# EAGLE schematic CapstoneProject16_latest (EAGLE 7.5.0)
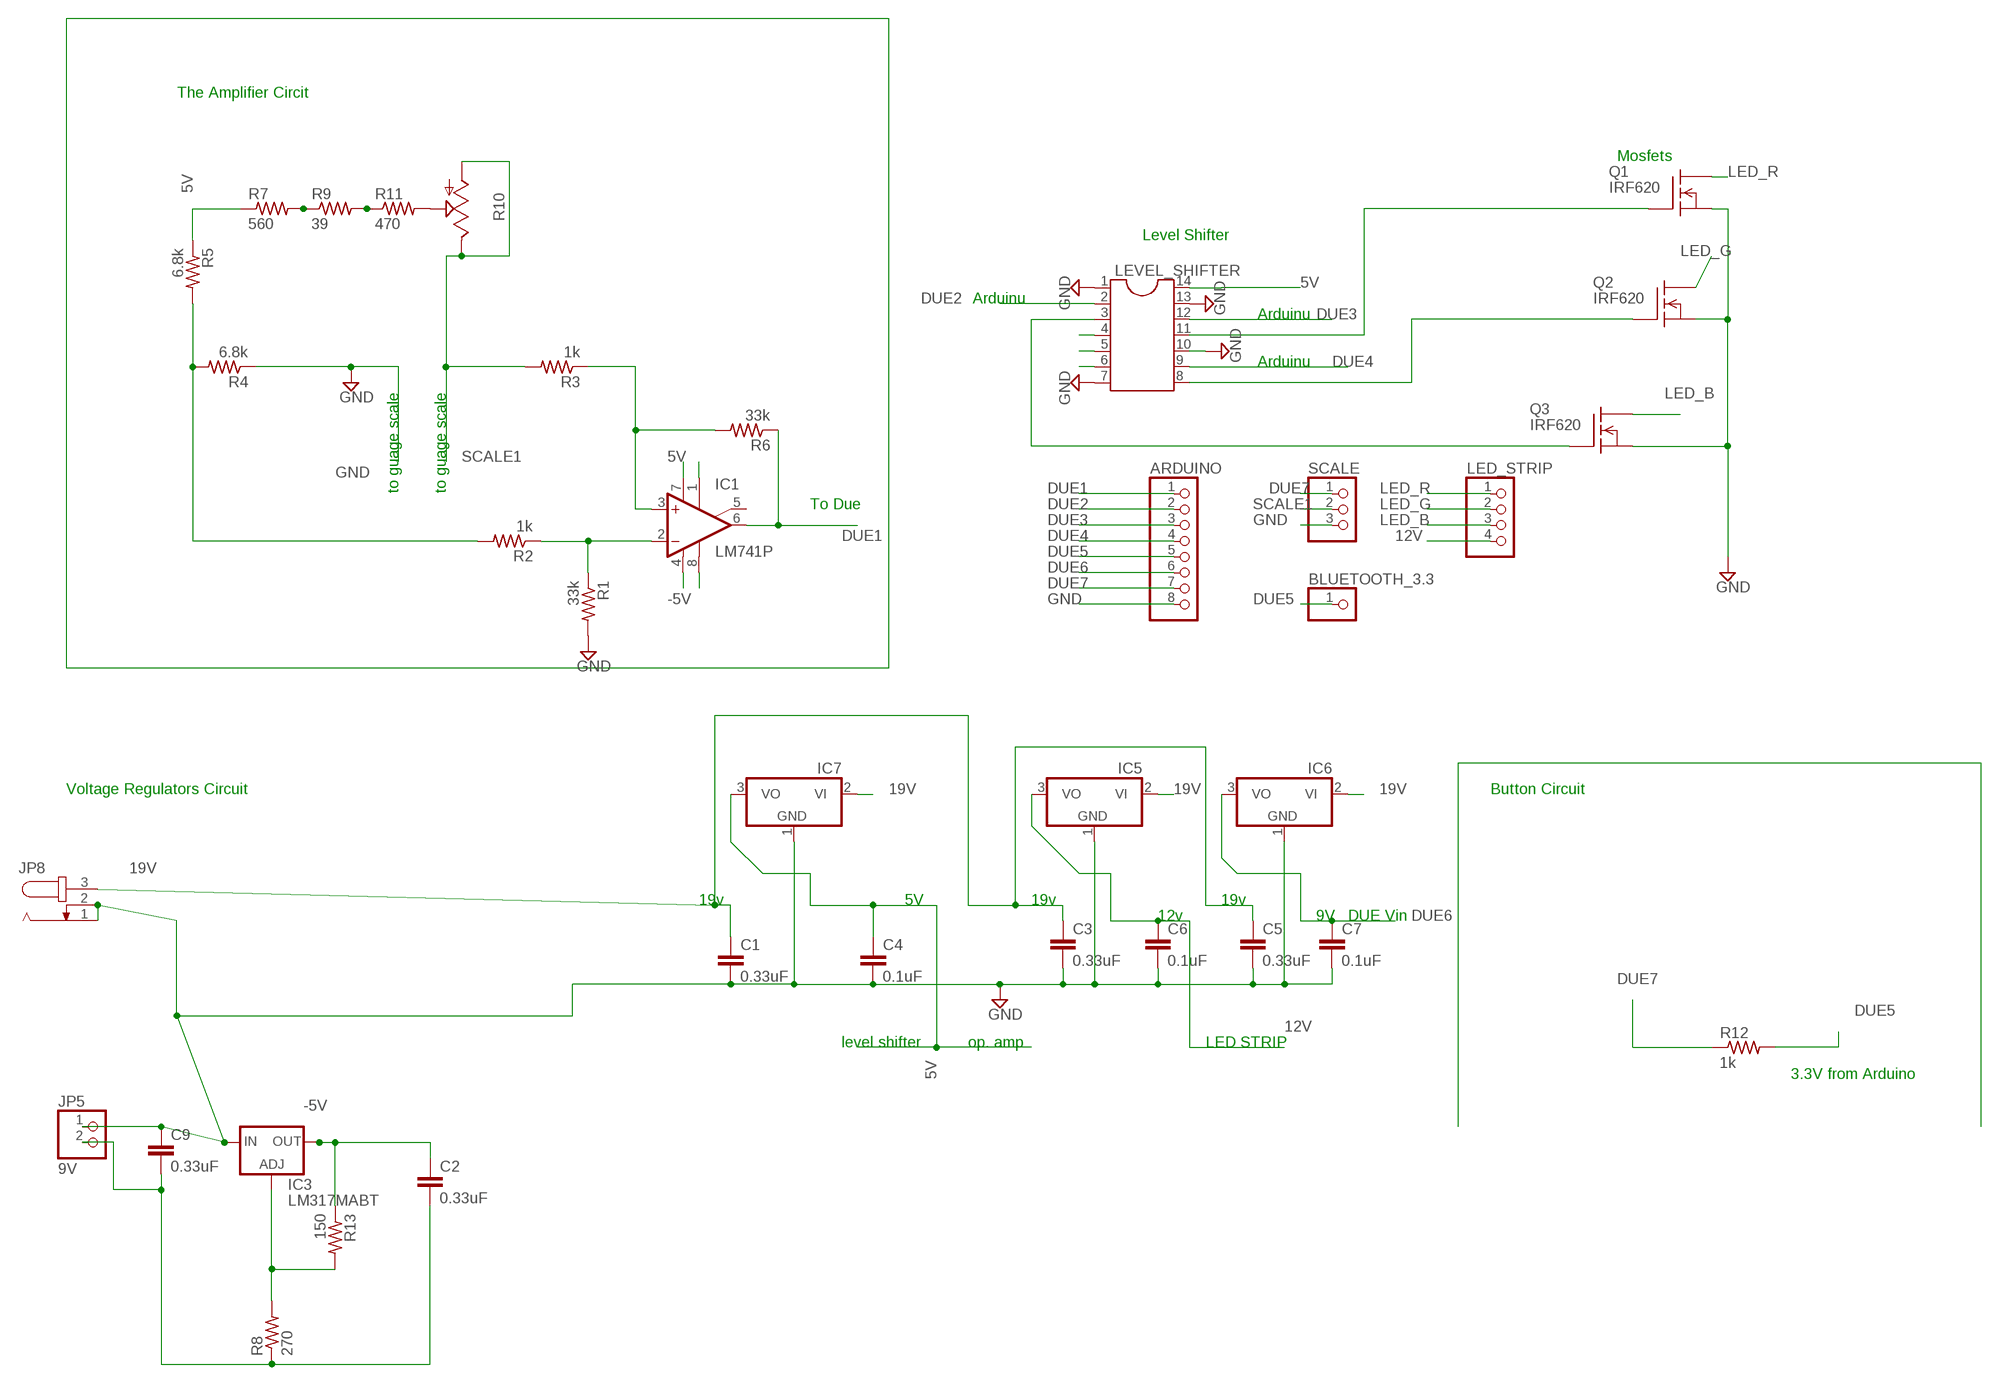
[diagram p0: schematic, sheet 1]

## Parts
ARDUINO  PINHD-1X8  [1X08]
BLUETOOTH_3.3  PINHD-1X1  [1X01]
C1  0.33uF  C2,5-3  [C2.5-3]
C2  0.33uF  C2,5-3  [C2.5-3]
C3  0.33uF  C2,5-3  [C2.5-3]
C4  0.1uF  C2,5-3  [C2.5-3]
C5  0.33uF  C2,5-3  [C2.5-3]
C6  0.1uF  C2,5-3  [C2.5-3]
C7  0.1uF  C2,5-3  [C2.5-3]
C9  0.33uF  C2,5-3  [C2.5-3]
IC1  LM741P  [DIL08]
IC3  LM317MABT  [TO220L1]
IC5  7905T  [TO220H]
IC6  7905T  [TO220H]
IC7  79L05Z  [TO92]
JP5  9V  PINHD-1X2  [1X02]
JP8  JACK-PLUG1  [SPC4078]
LED_STRIP  PINHD-1X4  [1X04]
LEVEL_SHIFTER  DIL14  [DIL14]
Q1  IRF620  [TO220]
Q2  IRF620  [TO220]
Q3  IRF620  [TO220]
R1  33k  R-US_0204/7  [0204/7]
R2  1k  R-US_0204/7  [0204/7]
R3  1k  R-US_0204/7  [0204/7]
R4  6.8k  R-US_0204/7  [0204/7]
R5  6.8k  R-US_0204/7  [0204/7]
R6  33k  R-US_0204/7  [0204/7]
R7  560  R-US_0204/7  [0204/7]
R8  270  R-US_0204/7  [0204/7]
R9  39  R-US_0204/7  [0204/7]
R10  TRIM_US-S63P  [S63P]
R11  470  R-US_0204/7  [0204/7]
R12  1k  R-US_0204/7  [0204/7]
R13  150  R-US_0204/7  [0204/7]
SCALE  PINHD-1X3  [1X03]

## Nets
5V: C4.1 IC1.7(V+) IC7.3(VO) LEVEL_SHIFTER.14 R5.1 R7.1
12V: C6.1 IC5.3(VO) LED_STRIP.4
19V: C1.1 C3.1 C5.1 IC5.2(VI) IC6.2(VI) IC7.2(VI) JP8.3
-5V: C2.1 IC1.4(V-) IC3.2(OUT) R13.1
DUE1: ARDUINO.1 IC1.6(OUT) R6.1
DUE2: ARDUINO.2 LEVEL_SHIFTER.2
DUE3: ARDUINO.3 LEVEL_SHIFTER.12
DUE4: ARDUINO.4 LEVEL_SHIFTER.9
DUE5: ARDUINO.5 BLUETOOTH_3.3.1 R12.2
DUE6: ARDUINO.6 C7.1 IC6.3(VO)
DUE7: ARDUINO.7 R12.1 SCALE.1
GND: ARDUINO.8 C1.2 C3.2 C4.2 C5.2 C6.2 C7.2 C9.1 IC3.3(IN) IC5.1(GND) IC6.1(GND) IC7.1(GND) JP5.1 JP8.1 JP8.2 LEVEL_SHIFTER.1 LEVEL_SHIFTER.7 LEVEL_SHIFTER.10 LEVEL_SHIFTER.13 Q1.3(S) Q2.3(S) Q3.3(S) R1.2 R4.1 SCALE.3
LED_B: LED_STRIP.3 Q3.2(D)
LED_G: LED_STRIP.2 Q2.2(D)
LED_R: LED_STRIP.1 Q1.2(D)
N$2: R2.2 R4.2 R5.2
N$3: IC1.2(-IN) R1.1 R2.1
N$4: IC1.3(+IN) R3.1 R6.2
N$5: LEVEL_SHIFTER.4
N$6: R10.S R11.2
N$8: LEVEL_SHIFTER.5
N$9: R7.2 R9.1
N$10: LEVEL_SHIFTER.6
N$12: C2.2 C9.2 JP5.2 R8.1
N$13: IC3.1(ADJ) R8.2 R13.2
N$15: R9.2 R11.1
N$27: LEVEL_SHIFTER.11 Q1.1(G)
N$28: LEVEL_SHIFTER.8 Q2.1(G)
N$29: LEVEL_SHIFTER.3 Q3.1(G)
N$31: IC1.1(ON1)
N$33: IC1.8(OPT)
SCALE1: R3.2 R10.A R10.E SCALE.2
Unconnected: IC1.5(ON2)

## Notes on the sheet
- The Amplifier Circit
- Mosfets
- Level Shifter
- Arduinu
- Arduinu
- Arduinu
- to guage scale | to guage scale
- To Due
- Voltage Regulators Circuit | Button Circuit
- 19v | 5V | 19v | 19v
- 12v | 9V | DUE Vin
- level shifter | op. amp | LED STRIP
- 3.3V from Arduino

## Library data of the parts
ARDUINO = pinhead:PINHD-1X8: PIN HEADER
BLUETOOTH_3.3 = pinhead:PINHD-1X1: PIN HEADER
C1-C7 C9 = capacitor-wima:C: CAPACITOR naming: grid - package width
IC1 = linear:*741: OP AMP
IC3 = v-reg:LM317?*: 500 mA Adjustable Output Positive Voltage Regulator Source: http://www.onsemi.co.jp .. LM317M-D.PDF
IC5-IC7 = linear:79*: Negative VOLTAGE REGULATOR
JP5 = pinhead:PINHD-1X2: PIN HEADER
JP8 = con-jack:JACK-PLUG: DC POWER JACK Power Jack, DC, Right Angle, Through Hole, Rated 5A at 16VDC, PC Terminals Distributor: Farnell (www.Farnell.de) Drawing: 84N1161.pdf / 84N1162.pdf Manufacturer: SPC Technology (www.spctechnology.com) Type: SPC4077 / SPC 4078; OC_FARNELL: unknown; OC_NEWARK: unknown
LED_STRIP = pinhead:PINHD-1X4: PIN HEADER
LEVEL_SHIFTER = ic-package:DIL14: Dual In Line / Socket
Q1-Q3 = transistor-fet:IRF620: N-Channel Enhancement MOSFET (HEXFET); 200V; 5,2A; 0,8Ohm
R1-R9 R11-R13 = resistor:R-US_: RESISTOR, American symbol
R10 = pot:TRIM_US-: POTENTIOMETER
SCALE = pinhead:PINHD-1X3: PIN HEADER